# EasyEDA schematic SCH_New-Project_2025-11-27.json
TITLE: Sheet_1; REV: 1.0; Date: 2025-11-25; Sheet: 1/1; Drawn By: imaginesis40; Company: Your Company
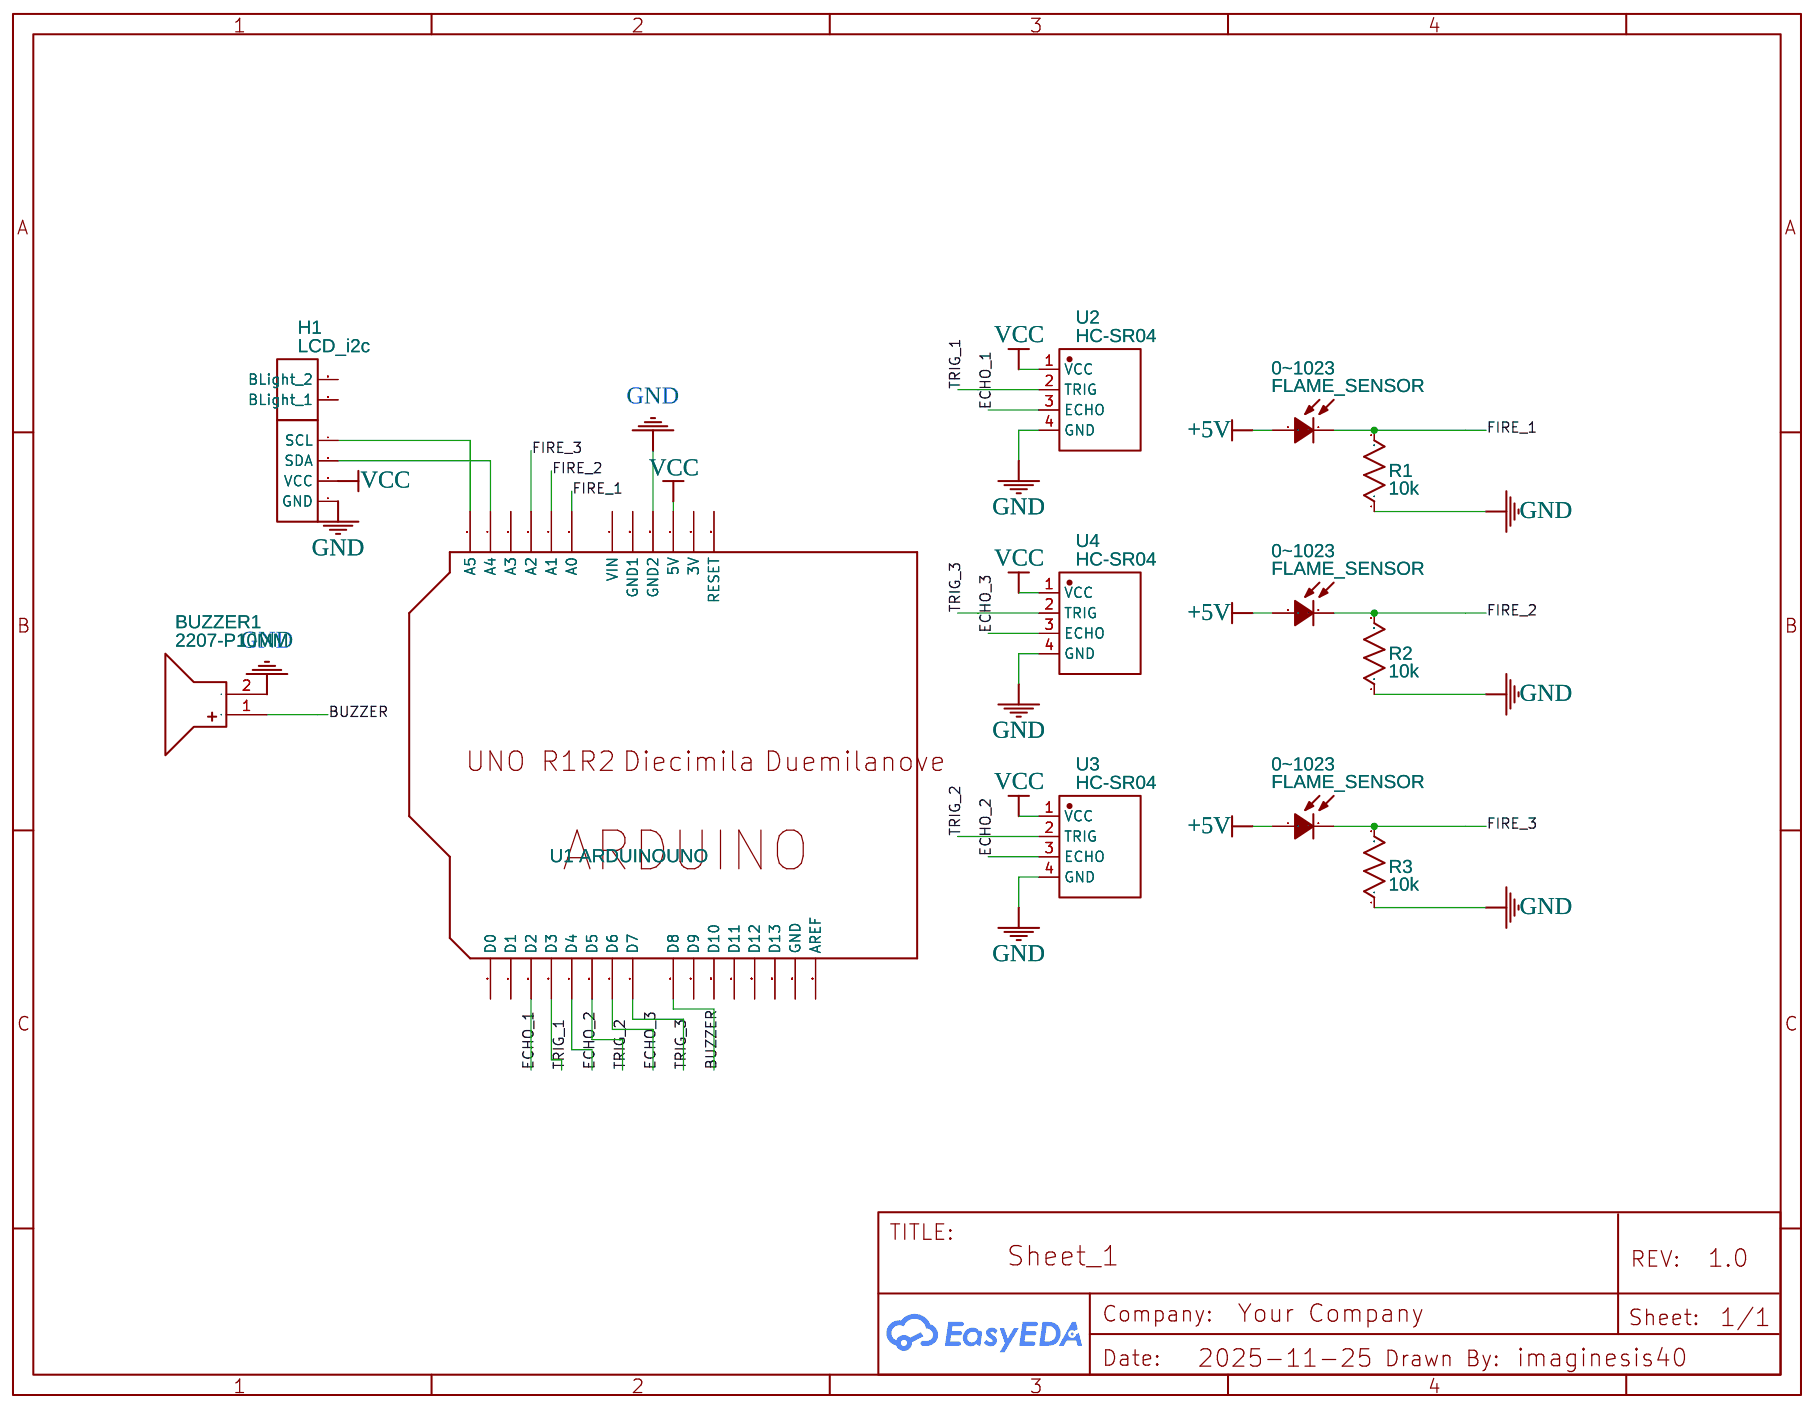
[diagram p0: schematic sheet]

## Parts
0&#126;1023  FLAME_SENSOR  [PHOTODIODE-5MM-200MIL]
0&#126;1023#2  FLAME_SENSOR  [PHOTODIODE-5MM-200MIL]
0&#126;1023#3  FLAME_SENSOR  [PHOTODIODE-5MM-200MIL]
0~1023  FLAME_SENSOR
BUZZER1  2207-P10MM  [BUZ-TH_BD22.0-P10.00_BUZZER_PIEZO_HX-2212]
H1  LCD_i2c  [LCD-TH_LCD-1602-2X16-I2C]
R1  10k  [R0603]
R2  10k  [R0603]
R3  10k  [R0603]
U1  ARDUINOUNO  [ARDUINO]
U2  HC-SR04  [TH_HC-SR04V]
U3  HC-SR04  [TH_HC-SR04V]
U4  HC-SR04  [TH_HC-SR04V]

## Library data of the parts
0&#126;1023 0&#126;1023#2 0&#126;1023#3 = PHOTODIODE-5MM: Contributor: tamimhasanbhuiyan
0~1023 = PHOTODIODE-5MM_2
BUZZER1 = 2207-P10MM: Supplier: LCSC; Supplier Part: C49246969; Manufacturer: XHXDZ(兴华鑫); Contributor: lcsc; JLCPCB Part Class: Extended Part
H1 = LCD_i2c: Contributor: amadosumbi3
R1-R3 = R_0603_US: Contributor: LCEDA_Lib
U1 = ARDUINOUNO: Arduino DiecimilaDuemilanove; Contributor: Adafruit
U2-U4 = HC-SR04: Supplier: LCSC; Supplier Part: C19857336; Manufacturer: Universal Microelectronics; Contributor: lcsc; JLCPCB Part Class: Extended Part

## Nets
+5V: 0&#126;1023.1(A) 0&#126;1023#2.1(A) 0&#126;1023#3.1(A)
GND: BUZZER1.2(-) H1.1(GND) R1.1 R2.1 R3.1 U1.GND2 U2.4(GND) U3.4(GND) U4.4(GND)
VCC: H1.2(VCC) U1.5V U2.1(VCC) U3.1(VCC) U4.1(VCC)
BUZZER: BUZZER1.1(+) U1.D8
ECHO_1: U1.D2 U2.3(ECHO)
ECHO_2: U1.D4 U3.3(ECHO)
ECHO_3: U1.D6 U4.3(ECHO)
FIRE_1: 0&#126;1023.2(K) R1.2 U1.A0
FIRE_2: 0&#126;1023#2.2(K) R2.2 U1.A1
FIRE_3: 0&#126;1023#3.2(K) R3.2 U1.A2
TRIG_1: U1.D3 U2.2(TRIG)
TRIG_2: U1.D5 U3.2(TRIG)
TRIG_3: U1.D7 U4.2(TRIG)
Net-(H1-3): H1.3(SDA) U1.A4
Net-(H1-4): H1.4(SCL) U1.A5

Not connected (* = marked no-connect by the designer): H1 5(BLight_1) 6(BLight_2); U1 3V A3 AREF D0 D1 D9 D10 D11 D12 D13 GND GND1 RESET VIN
